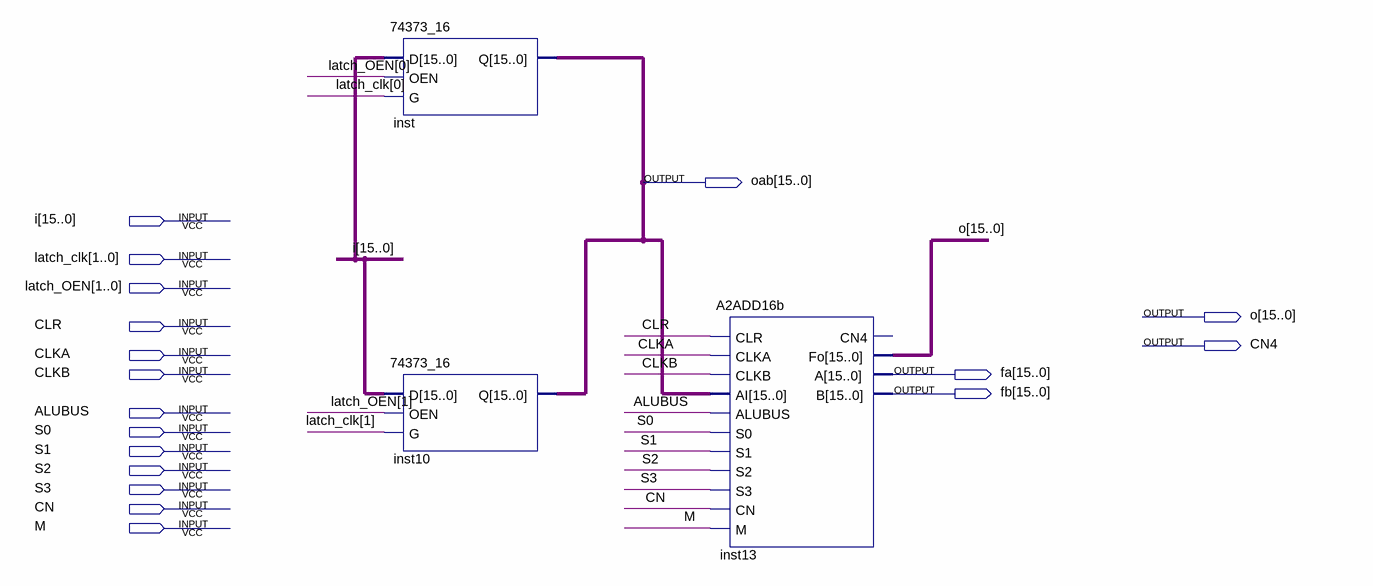
[diagram p0: schematic sheet]
// Quartus schematic A.bdf as structural Verilog: 3 symbols, 18 pins
module A (
  input  [15:0] i,
  input  [1:0] latch_clk,
  input  [1:0] latch_OEN,
  input  CLR,
  input  CLKA,
  input  CLKB,
  input  ALUBUS,
  input  S0,
  input  S1,
  input  S2,
  input  S3,
  input  CN,
  input  M,
  output [15:0] oab,
  output [15:0] o,
  output CN4,
  output [15:0] fa,
  output [15:0] fb
);

  \74373_16  inst (.D(i), .OEN(latch_OEN[0]), .G(latch_clk[0]), .Q(oab));
  \74373_16  inst10 (.D(i), .OEN(latch_OEN[1]), .G(latch_clk[1]), .Q(oab));
  A2ADD16b inst13 (
    .CLR(CLR), .CLKA(CLKA), .CLKB(CLKB), .AI(oab), .ALUBUS(ALUBUS), .S0(S0), .S1(S1), .S2(S2), .S3(S3),
    .CN(CN), .M(M), .Fo(o), .A(fa), .B(fb));  // open: CN4
endmodule
